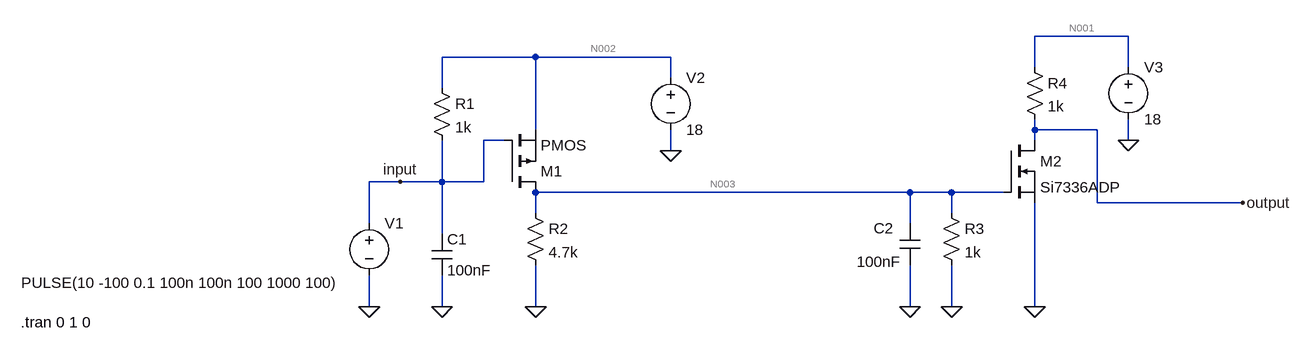
[diagram p0: schematic ac_adapter_inverter_logic.asc]
ac_adapter_inverter_logic.asc, the LTspice schematic file:
Version 4
SHEET 1 1376 680
WIRE 1104 -128 960 -128
WIRE 192 -96 48 -96
WIRE 400 -96 192 -96
WIRE 960 -80 960 -128
WIRE 1104 -80 1104 -128
WIRE 400 -64 400 -96
WIRE 48 -48 48 -96
WIRE 192 16 192 -96
WIRE 960 16 960 0
WIRE 1056 16 960 16
WIRE 144 32 112 32
WIRE 960 32 960 16
WIRE 1104 32 1104 0
WIRE 400 48 400 16
WIRE -16 96 -64 96
WIRE 48 96 48 32
WIRE 48 96 -16 96
WIRE 112 96 112 32
WIRE 112 96 48 96
WIRE 768 112 192 112
WIRE 832 112 768 112
WIRE 912 112 832 112
WIRE 1056 128 1056 16
WIRE 1280 128 1056 128
WIRE 192 144 192 112
WIRE 832 144 832 112
WIRE -64 160 -64 96
WIRE 768 160 768 112
WIRE 48 176 48 96
WIRE -64 288 -64 240
WIRE 48 288 48 240
WIRE 192 288 192 224
WIRE 768 288 768 224
WIRE 832 288 832 224
WIRE 960 288 960 128
FLAG 400 48 0
FLAG -64 288 0
FLAG 48 288 0
FLAG 192 288 0
FLAG 768 288 0
FLAG 832 288 0
FLAG 960 288 0
FLAG 1280 128 output
FLAG -16 96 input
FLAG 1104 32 0
SYMBOL voltage 400 -80 R0
WINDOW 123 0 0 Left 0
WINDOW 39 0 0 Left 0
SYMATTR InstName V2
SYMATTR Value 18
SYMBOL res 32 -64 R0
SYMATTR InstName R1
SYMATTR Value 1k
SYMBOL cap 32 176 R0
SYMATTR InstName C1
SYMATTR Value 100nF
SYMBOL res 176 128 R0
SYMATTR InstName R2
SYMATTR Value 4.7k
SYMBOL cap 752 160 R0
WINDOW 0 -40 7 Left 2
WINDOW 3 -66 59 Left 2
SYMATTR InstName C2
SYMATTR Value 100nF
SYMBOL res 816 128 R0
SYMATTR InstName R3
SYMATTR Value 1k
SYMBOL nmos 912 32 R0
SYMATTR InstName M2
SYMATTR Value Si7336ADP
SYMBOL res 944 -96 R0
SYMATTR InstName R4
SYMATTR Value 1k
SYMBOL voltage 1104 -96 R0
WINDOW 123 0 0 Left 0
WINDOW 39 0 0 Left 0
SYMATTR InstName V3
SYMATTR Value 18
SYMBOL voltage -64 144 R0
WINDOW 3 -535 107 Left 2
WINDOW 123 0 0 Left 0
WINDOW 39 0 0 Left 0
SYMATTR Value PULSE(10 -100 0.1 100n 100n 100 1000 100)
SYMATTR InstName V1
SYMBOL pmos 144 112 M180
SYMATTR InstName M1
TEXT -600 312 Left 2 !.tran 0 1 0

The netlist it stands for:
* ac_adapter_inverter_logic.asc
V2 N002 0 18
R1 N002 input 1k
C1 input 0 100nF
R2 N003 0 4.7k
C2 N003 0 100nF
R3 N003 0 1k
M2 output N003 0 0 Si7336ADP
R4 N001 output 1k
V3 N001 0 18
V1 input 0 PULSE(10 -100 0.1 100n 100n 100 1000 100)
M1 N003 input N002 N002 PMOS
.model NMOS NMOS
.model PMOS PMOS
.lib standard.mos
.tran 0 1 0
.backanno
.end

* Results of the author's LTspice run, read from the files saved beside the schematic
* Operating Point, zero values left out:
*   V(n002) = 18 V
*   V(input) = 10 V
*   V(n003) = 527.7 mV
*   V(output) = 18 V
*   V(n001) = 18 V
*   Id(M1) = -640 µA
*   Ib(M1) = 17.48 pA
*   Is(M1) = 640 µA
*   Id(M2) = 23.68 pA
*   Is(M2) = -23.68 pA
*   I(R4) = 42.02 pA
*   I(R3) = 527.7 µA
*   I(R2) = 112.3 µA
*   I(R1) = 8 mA
*   I(V1) = 8 mA
*   I(V3) = -42.02 pA
*   I(V2) = -8.64 mA
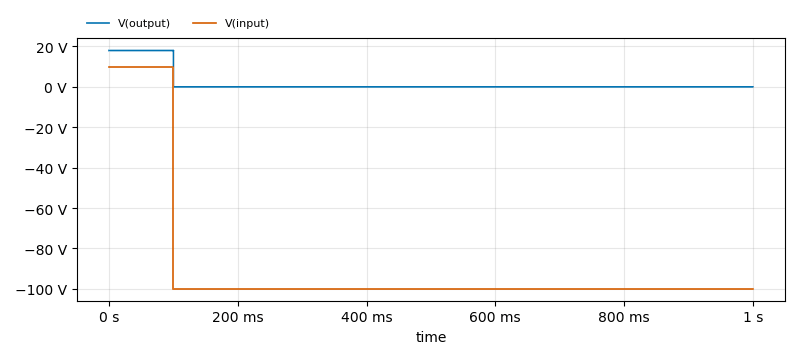
[diagram p1: Transient Analysis of ac_adapter_inverter_logic.asc, plotted from the saved traces]
* Transient Analysis, 1 run:
*   V(output): min 39.81 µV, max 18.07 V, average 1.8 V, rms 5.692 V, last 39.81 µV
*   V(input): min -100 V, max 10 V, average -89 V, rms 94.92 V, last -100 V